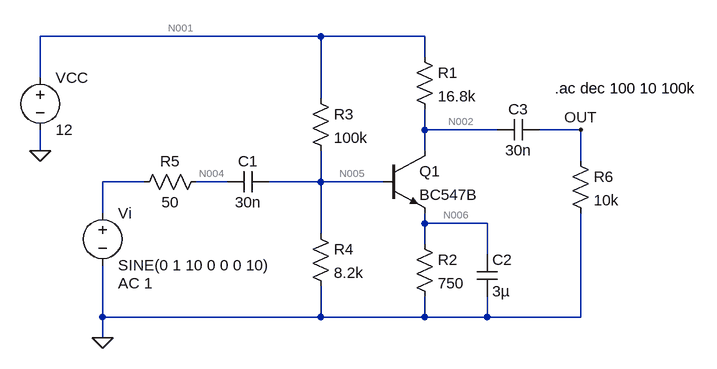
[diagram p0: schematic Sim_AmplificadorEj2.asc]
Sim_AmplificadorEj2.asc, the LTspice schematic file:
Version 4
SHEET 1 880 680
WIRE 80 -48 -352 -48
WIRE 240 -48 80 -48
WIRE 240 -16 240 -48
WIRE -352 16 -352 -48
WIRE 80 48 80 -48
WIRE 240 96 240 64
WIRE 352 96 240 96
WIRE 480 96 416 96
WIRE -352 128 -352 96
WIRE 240 128 240 96
WIRE 480 144 480 96
WIRE -192 176 -256 176
WIRE -64 176 -112 176
WIRE 80 176 80 128
WIRE 80 176 0 176
WIRE 176 176 80 176
WIRE -256 224 -256 176
WIRE 240 240 240 224
WIRE 336 240 240 240
WIRE 80 256 80 176
WIRE 240 272 240 240
WIRE 336 288 336 240
WIRE -256 384 -256 304
WIRE 80 384 80 336
WIRE 80 384 -256 384
WIRE 240 384 240 352
WIRE 240 384 80 384
WIRE 336 384 336 352
WIRE 336 384 240 384
WIRE 480 384 480 224
WIRE 480 384 336 384
WIRE -256 416 -256 384
FLAG -256 416 0
FLAG -352 128 0
FLAG 480 96 OUT
SYMBOL npn 176 128 R0
SYMATTR InstName Q1
SYMATTR Value BC547B
SYMBOL res 224 -32 R0
SYMATTR InstName R1
SYMATTR Value 16.8k
SYMBOL res 224 256 R0
SYMATTR InstName R2
SYMATTR Value 750
SYMBOL res 64 32 R0
SYMATTR InstName R3
SYMATTR Value 100k
SYMBOL res 64 240 R0
SYMATTR InstName R4
SYMATTR Value 8.2k
SYMBOL cap 0 160 R90
WINDOW 0 0 32 VBottom 2
WINDOW 3 32 32 VTop 2
SYMATTR InstName C1
SYMATTR Value 30n
SYMBOL res -96 160 R90
WINDOW 0 0 56 VBottom 2
WINDOW 3 32 56 VTop 2
SYMATTR InstName R5
SYMATTR Value 50
SYMBOL voltage -256 208 R0
WINDOW 123 24 124 Left 2
WINDOW 39 0 0 Left 2
SYMATTR Value2 AC 1
SYMATTR InstName Vi
SYMATTR Value SINE(0 1 10 0 0 0 10)
SYMBOL cap 320 288 R0
SYMATTR InstName C2
SYMATTR Value 3µ
SYMBOL cap 416 80 R90
WINDOW 0 0 32 VBottom 2
WINDOW 3 32 32 VTop 2
SYMATTR InstName C3
SYMATTR Value 30n
SYMBOL res 464 128 R0
SYMATTR InstName R6
SYMATTR Value 10k
SYMBOL voltage -352 0 R0
WINDOW 123 0 0 Left 2
WINDOW 39 0 0 Left 2
SYMATTR InstName VCC
SYMATTR Value 12
TEXT 440 32 Left 2 !.ac dec 100 10 100k

The netlist it stands for:
* Sim_AmplificadorEj2.asc
Q1 N002 N005 N006 0 BC547B
R1 N001 N002 16.8k
R2 N006 0 750
R3 N001 N005 100k
R4 N005 0 8.2k
C1 N005 N004 30n
R5 N004 N003 50
Vi N003 0 SINE(0 1 10 0 0 0 10) AC 1
C2 N006 0 3µ
C3 OUT N002 30n
R6 OUT 0 10k
VCC N001 0 12
.model NPN NPN
.model PNP PNP
.lib standard.bjt
.ac dec 100 10 100k
.backanno
.end

* Results of the author's LTspice run, read from the files saved beside the schematic
* Operating Point, zero values left out:
*   V(n002) = 5.564 V
*   V(n005) = 899.9 mV
*   V(n006) = 288.3 mV
*   V(n001) = 12 V
*   Ic(Q1) = 383.1 µA
*   Ib(Q1) = 1.259 µA
*   Ie(Q1) = -384.4 µA
*   I(R4) = 109.7 µA
*   I(R3) = 111 µA
*   I(R2) = 384.4 µA
*   I(R1) = 383.1 µA
*   I(Vcc) = -494.1 µA
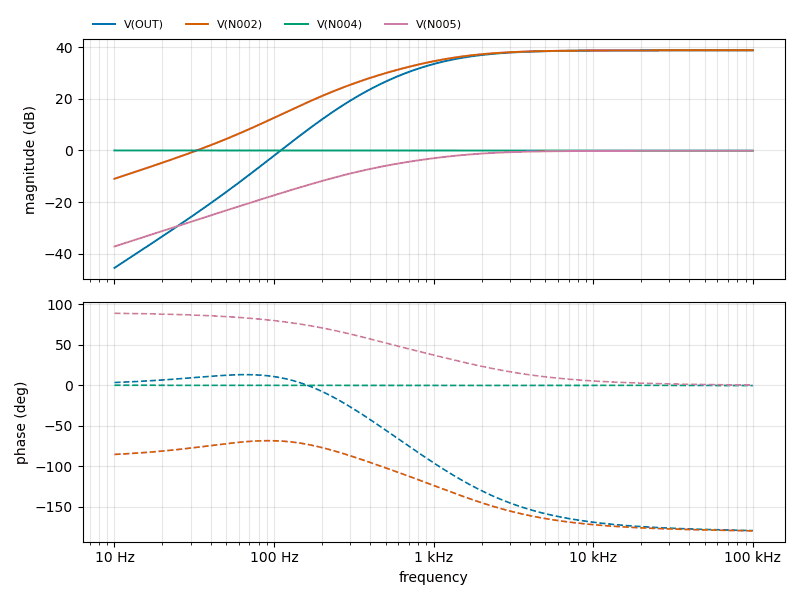
[diagram p1: AC Analysis of Sim_AmplificadorEj2.asc, plotted from the saved traces]
* AC Analysis, 1 run:
*   V(OUT): -45.47 dB at 10 Hz, 38.75 dB at 100 kHz, peak 38.75 dB at 100 kHz, 3 dB below the peak at 1.469 kHz
*   V(N002): -10.97 dB at 10 Hz, 38.75 dB at 100 kHz, peak 38.75 dB at 100 kHz, 3 dB below the peak at 1.287 kHz
*   V(N004): -0.00 dB at 10 Hz, -0.08 dB at 100 kHz, peak -0.00 dB at 10 Hz
*   V(N005): -37.19 dB at 10 Hz, -0.13 dB at 100 kHz, peak -0.13 dB at 100 kHz, 3 dB below the peak at 963 Hz